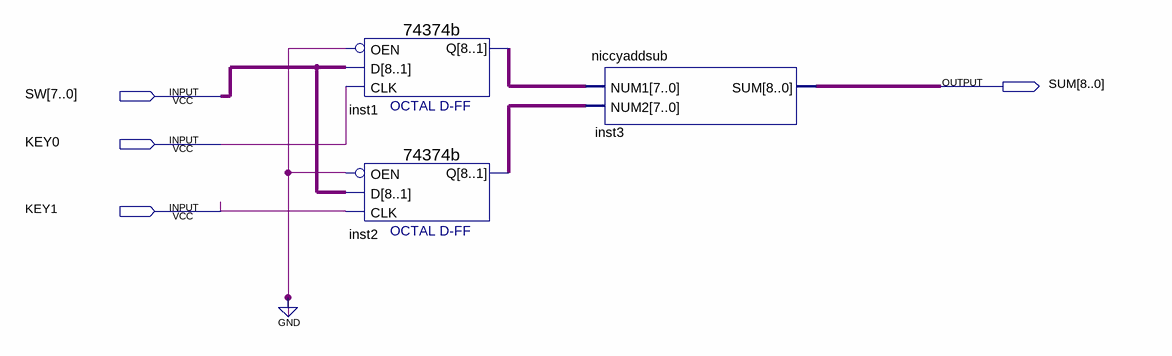
[diagram p0: schematic sheet]
// Quartus schematic niccybinaryadder.bdf as structural Verilog: 3 symbols, 4 pins
module niccybinaryadder (
  input  [7:0] SW,
  input  KEY0,
  input  KEY1,
  output [8:0] SUM
);

  wire [7:0] inst1_q, inst2_q;

  \74374b  inst1 (.D(SW), .OEN(1'b0), .CLK(KEY0), .Q(inst1_q));
  \74374b  inst2 (.D(SW), .OEN(1'b0), .CLK(KEY1), .Q(inst2_q));
  niccyaddsub inst3 (.NUM1(inst1_q), .NUM2(inst2_q), .SUM(SUM));
endmodule
